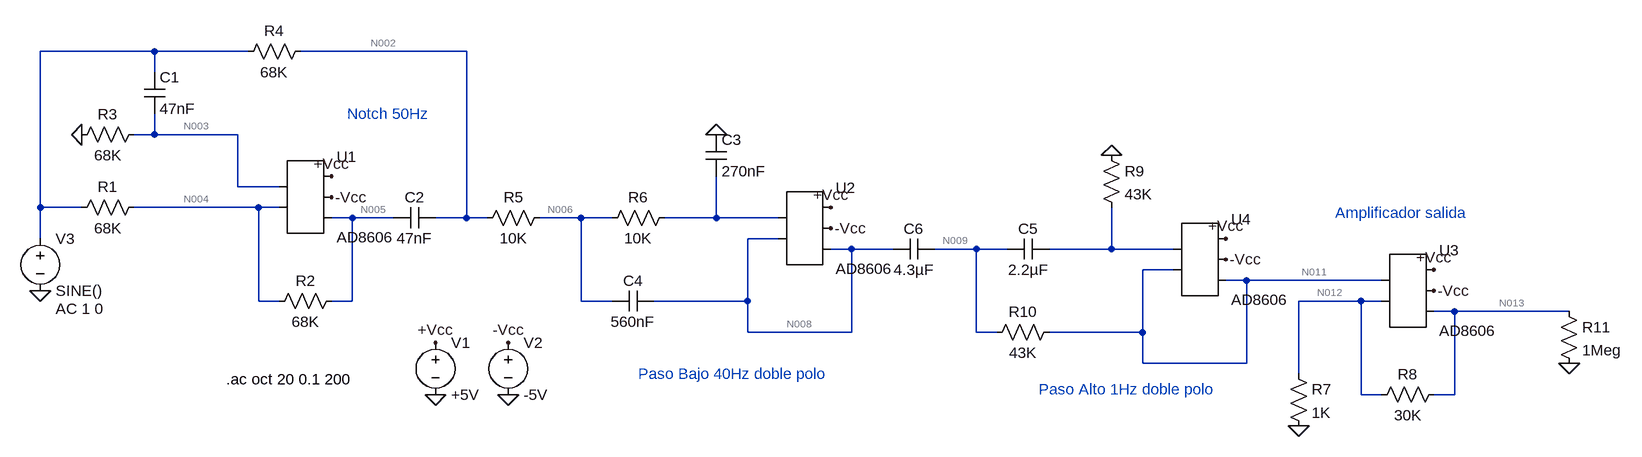
[diagram p0: schematic EECutre_v2.asc]
* EECutre_v2.asc
* U1: AD8606 (symbol AutoGenerated\AD8606 not available, pins judged from their places): pin1=N003 pin2=N004 pin3=+Vcc pin4=-Vcc pin5=N005
R1 N004 N001 68K
R3 N003 0 68K
C1 N001 N003 47nF
R4 N002 N001 68K
C2 N002 N005 47nF
* U2: AD8606 (symbol AutoGenerated\AD8606 not available, pins judged from their places): pin1=N007 pin2=N008 pin3=+Vcc pin4=-Vcc pin5=N008
R5 N006 N002 10K
R6 N007 N006 10K
C3 0 N007 270nF
C4 N008 N006 560nF
* U3: AD8606 (symbol AutoGenerated\AD8606 not available, pins judged from their places): pin1=N011 pin2=N012 pin3=+Vcc pin4=-Vcc pin5=N013
R7 N012 0 1K
R8 N013 N012 30K
* U4: AD8606 (symbol AutoGenerated\AD8606 not available, pins judged from their places): pin1=N010 pin2=N011 pin3=+Vcc pin4=-Vcc pin5=N011
R9 0 N010 43K
R10 N011 N009 43K
C5 N010 N009 2.2µF
C6 N009 N008 4.3µF
R11 N013 0 1Meg
V1 +Vcc 0 +5V
V2 -Vcc 0 -5V
V3 N001 0 SINE() AC 1 0
R2 N005 N004 68K
* Notch 50Hz
* Paso Bajo 40Hz doble polo
* Amplificador salida
* Paso Alto 1Hz doble polo
.ac oct 20 0.1 200
.backanno
.end

* Results of the author's LTspice run, read from the files saved beside the schematic
* Operating Point, zero values left out:
*   V(n004) = -167.8 µV
*   V(-vcc) = -5 V
*   V(+vcc) = 5 V
*   V(n005) = -335.7 µV
*   V(n008) = -167.8 µV
*   V(n012) = -335.7 µV
*   V(n011) = -167.8 µV
*   V(n013) = -10.41 mV
*   V(n009) = -167.8 µV
*   I(R1) = -2.468 nA
*   I(R7) = -335.7 nA
*   I(R8) = -335.7 nA
*   I(R11) = -10.41 nA
*   I(R2) = -2.468 nA
*   I(V1) = -3.142 mA
*   I(V2) = 3.142 mA
*   I(V3) = -2.468 nA
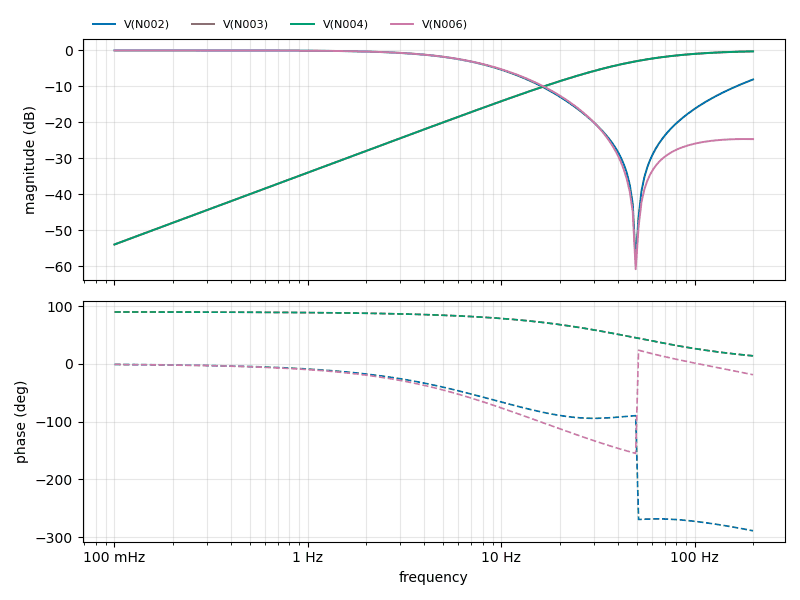
[diagram p1: AC Analysis of EECutre_v2.asc, plotted from the saved traces]
* AC Analysis, 1 run:
*   V(N002): -0.00 dB at 100 mHz, -8.09 dB at 200 Hz, peak -0.00 dB at 100 mHz, 3 dB below the peak at 6.812 Hz
*   V(N003): -53.94 dB at 100 mHz, -0.26 dB at 200 Hz, peak -0.26 dB at 200 Hz, 3 dB below the peak at 46.98 Hz
*   V(N004): -53.94 dB at 100 mHz, -0.26 dB at 200 Hz, peak -0.26 dB at 200 Hz, 3 dB below the peak at 46.98 Hz
*   V(N006): -0.00 dB at 100 mHz, -24.67 dB at 200 Hz, peak -0.00 dB at 100 mHz, 3 dB below the peak at 6.903 Hz